# Altium schematic sheet IO2.SchDoc
size A4; SheetNumber: 5; SheetTotal: 5
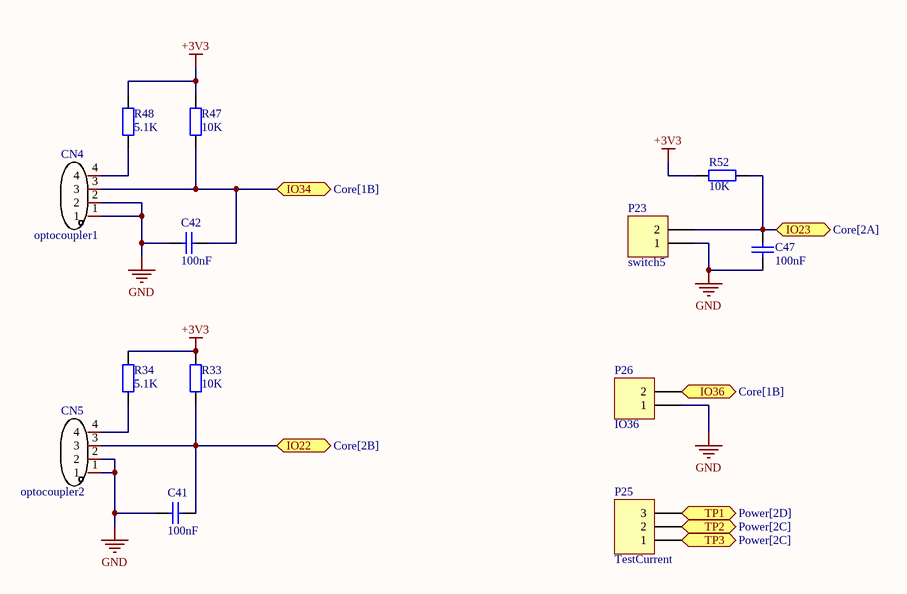
[diagram p0: IO2.SchDoc]

## Parts
C41  value 100nF  [6-0805_N]  (hidden comment: Cap)
C42  value 100nF  [6-0805_N]  (hidden comment: Cap)
C47  value 100nF  [6-0805_N]  (hidden comment: Cap)
CN4  Name: optocoupler1  [CONN-TH_4P-P2.50_4PIN]  (hidden comment: ZX-XH2.54-4PZZ)
CN5  Name: optocoupler2  [CONN-TH_4P-P2.50_4PIN]  (hidden comment: ZX-XH2.54-4PZZ)
P23  switch5  [HDR1X2]
P25  TestCurrent  [HDR1X3]
P26  IO36  [HDR1X2]
R33  value 10K  [6-0805_N]  (hidden comment: Res2)
R34  value 5.1K  [6-0805_N]  (hidden comment: Res2)
R47  value 10K  [6-0805_N]  (hidden comment: Res2)
R48  value 5.1K  [6-0805_N]  (hidden comment: Res2)
R52  value 10K  [6-0805_N]  (hidden comment: Res2)

## Ports
IO22 (bidir, see Core[2B]), IO23 (bidir, see Core[2A]), IO34 (bidir, see Core[1B]), IO36 (bidir, see Core[1B]), TP1 (bidir, see Power[2D]), TP2 (bidir, see Power[2C]), TP3 (bidir, see Power[2C])

## Nets
+3V3: R33.2 R34.2 R47.1 R48.1 R52.1
GND: C41.2 C42.2 C47.1 CN4.1 CN4.2 CN5.1 CN5.2 P23.1 P26.1
IO22: C41.1 CN5.3 R33.1 ; port IO22
IO23: C47.2 P23.2 R52.2 ; port IO23
IO34: C42.1 CN4.3 R47.2 ; port IO34
IO36: P26.2 ; port IO36
TP1: P25.3 ; port TP1
TP2: P25.2 ; port TP2
TP3: P25.1 ; port TP3
NetCN4_4: CN4.4 R48.2
NetCN5_4: CN5.4 R34.1

## Library data of the parts
C41 C42 C47 = Cap: Capacitor; Published: 8-Jun-2000; LatestRevisionDate: 17-Jul-2002; LatestRevisionNote: Re-released for DXP Platform.; PackageReference: RAD-0.3; Publisher: Altium Limited; PackageDescription: Radial Cap, Thru-Hole; 2 Leads; 0.3 in Pin Spacing
CN4 CN5 = ZX-XH2.54-4PZZ: Manufacturer: Megastar(兆星); Add into BOM: yes; Pins Structure: 1x4P; Pitch: 2.54mm; Reference Series: XH; Number of PINs Per Row: 4; Current Rating (Max): 3A; Symbol: ZX-XH2.54-4PZZ; Device: ZX-XH2.54-4PZZ; LCSC Part Name: ZX-XH2.54-4PZZ; Supplier Part: C7429634; Manufacturer Part: ZX-XH2.54-4PZZ; Supplier Footprint: 插件,P=2.54mm; JLCPCB Part Class: 扩展库; Datasheet: https://atta.szlcsc.com/upload/public/pdf/source/20230619/B529A2163E0159A644AB3383D208FB03.pdf; Supplier: LCSC; Convert to PCB: yes; Mounting Style: 直插; Number of Pins: 4P; Number of Rows: 1; Row Spacing: -; Contact Material: 黄铜; Contact Plating: 锡; Operating Temperature Range: -25℃~+85℃
P23 P26 = Header 2: Header, 2-Pin; LatestRevisionDate: 17-Jul-2002; LatestRevisionNote: Re-released for DXP Platform.; Publisher: Altium Limited
P25 = Header 3: Header, 3-Pin; LatestRevisionDate: 17-Jul-2002; LatestRevisionNote: Re-released for DXP Platform.; Publisher: Altium Limited
R33 R34 R47 R48 R52 = Res2: Resistor; Published: 8-Jun-2000; LatestRevisionDate: 17-Jul-2002; LatestRevisionNote: Re-released for DXP Platform.; PackageReference: AXIAL-0.4; Publisher: Altium Limited; PackageDescription: Axial Device, Thru-Hole; 2 Leads; 0.4 in Pin Spacing